# Altium schematic sheet Kajtuś-DSP_user_interface.SchDoc
size A4; DocumentNumber: 7; SheetNumber: 7; SheetTotal: 9
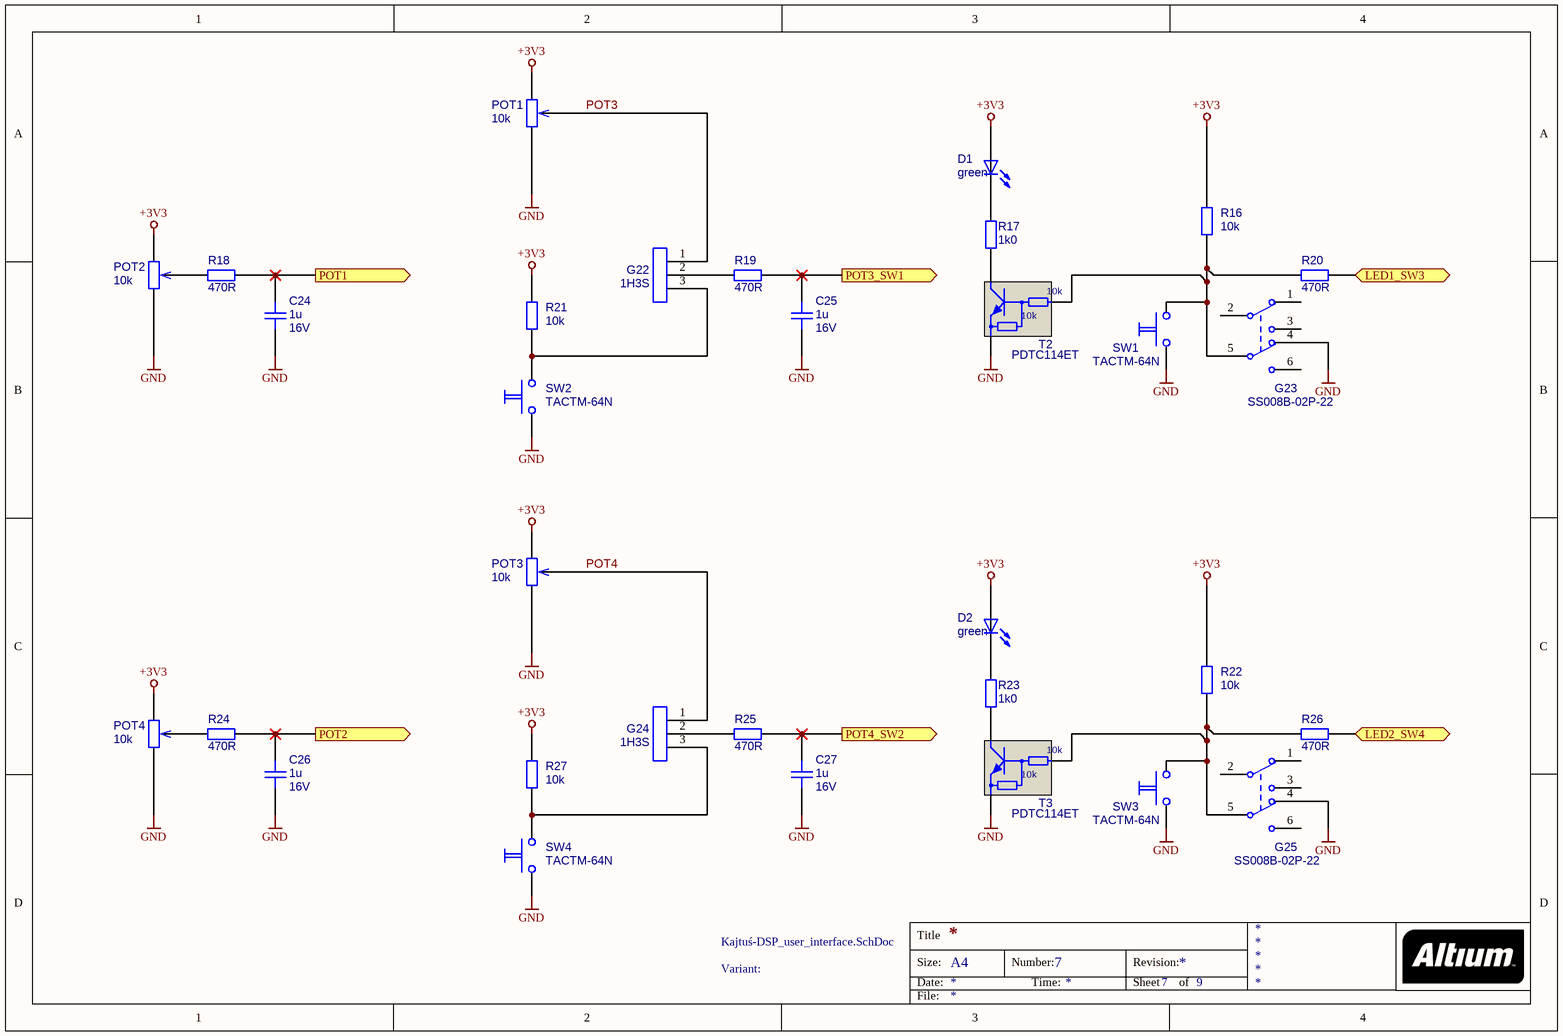
[diagram p0: Kajtuś-DSP_user_interface.SchDoc]

## Parts
C24  Voltage: 16V  [C_0603_MA]  (hidden comment: 1u)
C25  Voltage: 16V  [C_0603_MA]  (hidden comment: 1u)
C26  Voltage: 16V  [C_0603_MA]  (hidden comment: 1u)
C27  Voltage: 16V  [C_0603_MA]  (hidden comment: 1u)
D1  green  [LED_0805_G]
D2  green  [LED_0805_G]
G22  value 1H3S  [1H3S_FHS]  (hidden comment: G_1H3S)
G23  SS008B-02P-22  [SW_DPDT_SS008B-02P-22]
G24  value 1H3S  [1H3S_FHS]  (hidden comment: G_1H3S)
G25  SS008B-02P-22  [SW_DPDT_SS008B-02P-22]
POT1  10k  [POT_BOURNS_3362P]
POT2  10k  [POT_BOURNS_3362P]
POT3  10k  [POT_BOURNS_3362P]
POT4  10k  [POT_BOURNS_3362P]
R16  value 10k  [R_0603_MA]  (hidden comment: R_0603_10k_5%)
R17  value 1k0  [R_0603_MA]  (hidden comment: R_0603_1k0_5%)
R18  value 470R  [R_0603_MA]  (hidden comment: R_0603_470R_5%)
R19  value 470R  [R_0603_MA]  (hidden comment: R_0603_470R_5%)
R20  value 470R  [R_0603_MA]  (hidden comment: R_0603_470R_5%)
R21  value 10k  [R_0603_MA]  (hidden comment: R_0603_10k_5%)
R22  value 10k  [R_0603_MA]  (hidden comment: R_0603_10k_5%)
R23  value 1k0  [R_0603_MA]  (hidden comment: R_0603_1k0_5%)
R24  value 470R  [R_0603_MA]  (hidden comment: R_0603_470R_5%)
R25  value 470R  [R_0603_MA]  (hidden comment: R_0603_470R_5%)
R26  value 470R  [R_0603_MA]  (hidden comment: R_0603_470R_5%)
R27  value 10k  [R_0603_MA]  (hidden comment: R_0603_10k_5%)
SW1  value TACTM-64N  [SW_TACTM-64N]  (hidden comment: SW_TACTM-64N)
SW2  value TACTM-64N  [SW_TACTM-64N]  (hidden comment: SW_TACTM-64N)
SW3  value TACTM-64N  [SW_TACTM-64N]  (hidden comment: SW_TACTM-64N)
SW4  value TACTM-64N  [SW_TACTM-64N]  (hidden comment: SW_TACTM-64N)
T2  PDTC114ET  [SOT-23]
T3  PDTC114ET  [SOT-23]

## Ports
LED1_SW3, LED2_SW4, POT1 (out), POT2 (out), POT3_SW1 (out), POT4_SW2 (out)

## Nets
+3V3: D1.1(A) D2.1(A) POT1.1 POT2.1 POT3.1 POT4.1 R16.1 R21.1 R22.1 R27.1
GND: C24.2 C25.2 C26.2 C27.2 G23.4(NC2) G25.4(NC2) POT1.3 POT2.3 POT3.3 POT4.3 SW1.1 SW2.1 SW3.1 SW4.1 T2.2(E) T3.2(E)
LED1_SW3: R20.2 ; port LED1_SW3
LED2_SW4: R26.2 ; port LED2_SW4
POT1: C24.1 R18.2 ; port POT1
POT2: C26.1 R24.2 ; port POT2
POT3: G22.1 POT1.2
POT3_SW1: C25.1 R19.2 ; port POT3_SW1
POT4: G24.1 POT3.2
POT4_SW2: C27.1 R25.2 ; port POT4_SW2
NetD1_2: D1.2(K) R17.1
NetD2_2: D2.2(K) R23.1
NetG22_2: G22.2 R19.1
NetG22_3: G22.3 R21.2 SW2.4
NetG23_5: G23.5(COM2) R16.2 R20.1 SW1.4 T2.1(B)
NetG24_2: G24.2 R25.1
NetG24_3: G24.3 R27.2 SW4.4
NetG25_5: G25.5(COM2) R22.2 R26.1 SW3.4 T3.1(B)
NetPOT2_2: POT2.2 R18.1
NetPOT4_2: POT4.2 R24.1
NetR17_2: R17.2 T2.3(C)
NetR23_2: R23.2 T3.3(C)

Not connected (* = marked no-connect by the designer): G23 1(NC1) 2(COM1) 3(NO1) 6(NO2); G25 1(NC1) 2(COM1) 3(NO1) 6(NO2)

## Notes on the sheet
- Variant:
- Title
- Size:
- Date:
- A4
- Number:
- Time:
- Revision:
- Sheet
- of
- File:
- (in symbol T_SOT-23_PDTC114ET) 10k

## Library data of the parts
C24-C27 = C_0603_1u_16V_X5R: Kondensator ceramiczny SMD; Vendor: TME; Part Number: C_0603_1u_16V_X5R; Value: 1u
D1 D2 = LED_SMD_generic: Dioda LED SMD; Vendor: ??; Part Number: LED_SMD_generic; Manufacturer: ??; Voltage: ??; Current: ??; Manufacturer Part Number: ??; Value: green
G22 G24 = G_1H3S: Listwa jednorzędowa, 1x3 piny, raster 2,54mm; Manufacturer: generic; Vendor: TME; Part Number: G_1H3S
G23 G25 = SW_DPDT_SS008B-02P-22: Przełącznik suwakowy, DPTD; Manufacturer: Canal Electronic; Vendor Part Number: SS008B02P22; Vendor: TME; Part Number: SW_DPDT_SS008B-02P-22; Value: SS008B-02P-22
POT1-POT4 = POT_10k_BOURNS_3362P: Potencjometr; Part Number: ??; Manufacturer: bOURNS; Vendor: TME; Value: 10k
R16 R21 R22 R27 = R_0603_10k_5%: Rezystor SMD; Manufacturer: Royal Ohm; Vendor: TME; Tolerance: 5%; Part Number: R_0603_10k_5%
R17 R23 = R_0603_1k0_5%: Rezystor SMD; Manufacturer: Royal Ohm; Vendor: TME; Tolerance: 5%; Part Number: R_0603_1k0_5%
R18-R20 R24-R26 = R_0603_470R_5%: Rezystor SMD; Manufacturer: Royal Ohm; Vendor: TME; Tolerance: 5%; Part Number: R_0603_470R_5%
SW1-SW4 = SW_TACTM-64N: Microswitch; Manufacturer: Ninigi; Vendor: TME; Part Number: SW_TACTM-64N
T2 T3 = T_SOT-23_PDTC114ET: NPN resistor-equipped transistor; R1=10k, R2=10k; Producent: NXP; Oznaczenie: PDTC114ET; Parametry: R1=10k, R2=10k